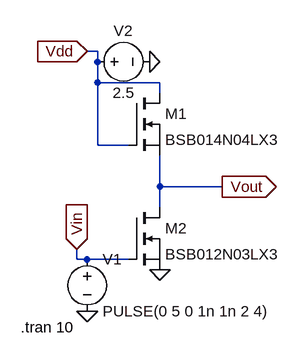
[diagram p0: schematic Inverter_testckt.asc]
Inverter_testckt.asc, the LTspice schematic file:
Version 4
SHEET 1 880 680
WIRE 96 -224 80 -224
WIRE 96 -208 96 -224
WIRE 96 -176 96 -208
WIRE 192 -176 96 -176
WIRE 192 -160 192 -176
WIRE 96 -80 96 -176
WIRE 144 -80 96 -80
WIRE 192 -16 192 -64
WIRE 288 -16 192 -16
WIRE 192 16 192 -16
WIRE 64 96 64 80
WIRE 80 96 64 96
WIRE 144 96 80 96
FLAG 192 112 0
FLAG 80 -224 Vdd
IOPIN 80 -224 In
FLAG 288 -16 Vout
IOPIN 288 -16 Out
FLAG 64 80 Vin
IOPIN 64 80 In
FLAG 80 176 0
FLAG 176 -208 0
SYMBOL nmos 144 -160 R0
SYMATTR InstName M1
SYMATTR Value BSB014N04LX3
SYMBOL nmos 144 16 R0
SYMATTR InstName M2
SYMATTR Value BSB012N03LX3
SYMBOL voltage 80 80 R0
WINDOW 123 0 0 Left 0
WINDOW 39 0 0 Left 0
SYMATTR InstName V1
SYMATTR Value PULSE(0 5 0 1n 1n 2 4)
SYMBOL voltage 80 -208 R270
WINDOW 0 32 56 VTop 2
WINDOW 3 -32 56 VBottom 2
WINDOW 123 0 0 Left 0
WINDOW 39 0 0 Left 0
SYMATTR InstName V2
SYMATTR Value 2.5
TEXT -22 200 Left 2 !.tran 10

The netlist it stands for:
* Inverter_testckt.asc
M1 Vdd Vdd Vout Vout BSB014N04LX3
M2 Vout Vin 0 0 BSB012N03LX3
V1 Vin 0 PULSE(0 5 0 1n 1n 2 4)
V2 Vdd 0 2.5
.model NMOS NMOS
.model PMOS PMOS
.lib standard.mos
.tran 10
.backanno
.end